# Altium schematic sheet radio-interface.SchDoc
size Letter; CompanyName: Signal Laboratories, Inc.; Address1: 3479 Edison Way; Address2: Menlo Park CA 94025; Address3: +1 (877) 778-8435; Address4: siglabs.com; Revision: 1; SheetNumber: 1; SheetTotal: 1
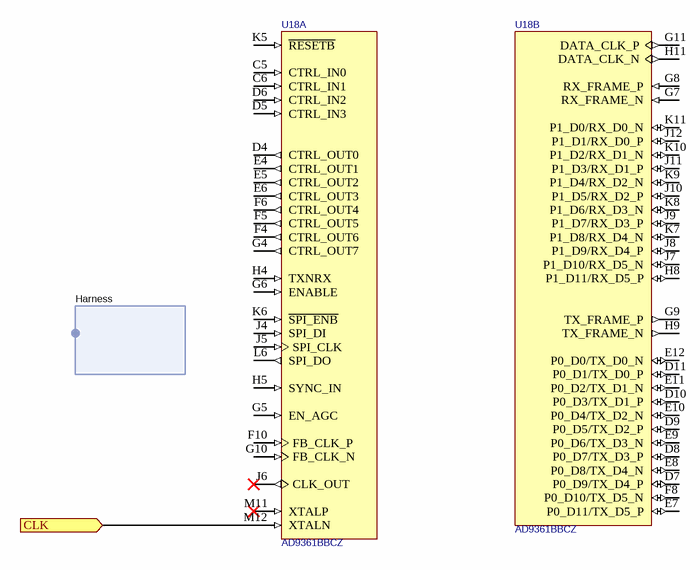
[diagram p0: radio-interface.SchDoc]

## Parts
U18  AD9361BBCZ  [BGA144C80P12X12_1000X1000X170_AD9361BBCZ(Primary)]  (parts A,B of 4)

## Ports
CLK (in)

## Harnesses
Harness: 

## Nets
CLK: U18.M12(XTALN) ; port CLK

Not connected (* = marked no-connect by the designer): U18 C5(CTRL_IN0) C6(CTRL_IN1) D4(CTRL_OUT0) D5(CTRL_IN3) D6(CTRL_IN2) D7(P0_D9/TX_D4_P) D8(P0_D7/TX_D3_P) D9(P0_D5/TX_D2_P) D10(P0_D3/TX_D1_P) D11(P0_D1/TX_D0_P) E4(CTRL_OUT1) E5(CTRL_OUT2) E6(CTRL_OUT3) E7(P0_D11/TX_D5_P) E8(P0_D8/TX_D4_N) E9(P0_D6/TX_D3_N) E10(P0_D4/TX_D2_N) E11(P0_D2/TX_D1_N) E12(P0_D0/TX_D0_N) F4(CTRL_OUT6) F5(CTRL_OUT5) F6(CTRL_OUT4) F8(P0_D10/TX_D5_N) F10(FB_CLK_P) G4(CTRL_OUT7) G5(EN_AGC) G6(ENABLE) G7(RX_FRAME_N) G8(RX_FRAME_P) G9(TX_FRAME_P) G10(FB_CLK_N) G11(DATA_CLK_P) H4(TXNRX) H5(SYNC_IN) H8(P1_D11/RX_D5_P) H9(TX_FRAME_N) H11(DATA_CLK_N) J4(SPI_DI) J5(SPI_CLK) J6(CLK_OUT)* J7(P1_D10/RX_D5_N) J8(P1_D9/RX_D4_P) J9(P1_D7/RX_D3_P) J10(P1_D5/RX_D2_P) J11(P1_D3/RX_D1_P) J12(P1_D1/RX_D0_P) K5(~{RESETB}) K6(~{SPI_ENB}) K7(P1_D8/RX_D4_N) K8(P1_D6/RX_D3_N) K9(P1_D4/RX_D2_N) K10(P1_D2/RX_D1_N) K11(P1_D0/RX_D0_N) L6(SPI_DO) M11(XTALP)*

## Notes on the sheet
- Title
- Engineer
- Revision
- Drawn By
- Checked By
- Date
- Sheet
- of

## Library data of the parts
U18 = AD9361: RF Agile Transceiver